# EAGLE design irTxRxComponent (EAGLE 9.5.1)
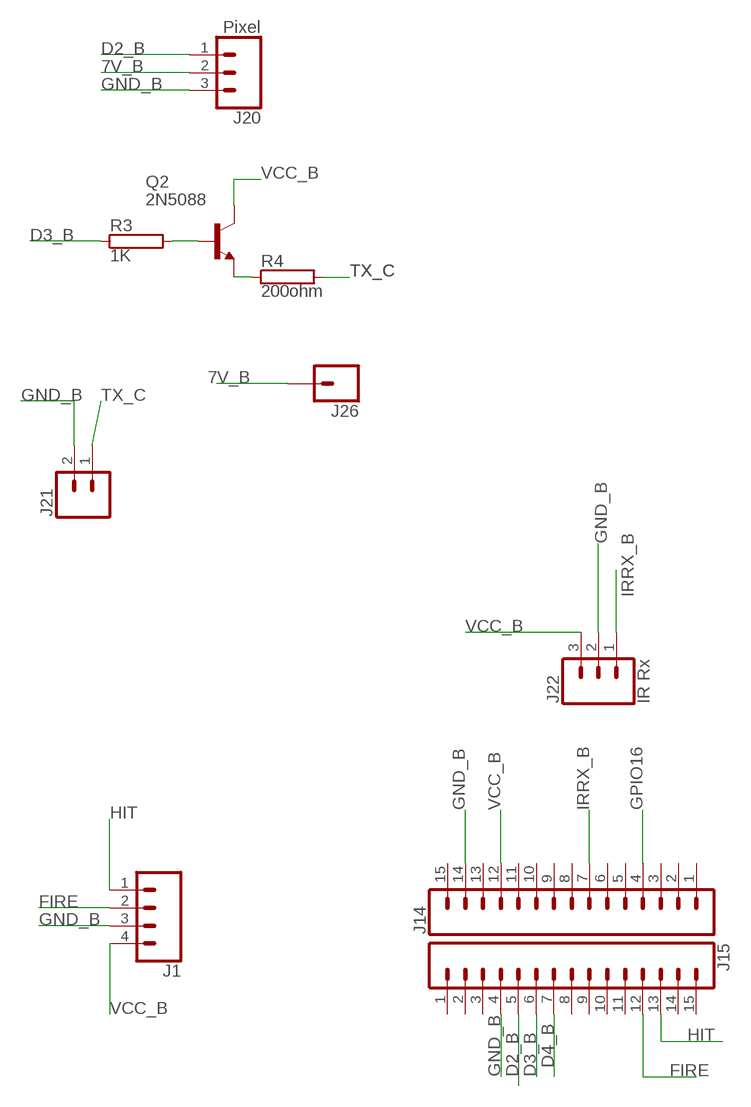
[diagram p0: schematic, sheet 1]

## Parts
J1  CONN_04  [1X04]
J14  CONN_15  [1X15]
J15  CONN_15  [1X15]
J20  Pixel  CONN_03  [1X03]
J21  CONN_02  [1X02]
J22  IR Rx  CONN_03  [1X03]
J26  CONN_01  [1X01]
Q2  2N5088  [TO92]
R3  1K  RCA0001  [CA0001]
R4  200ohm  RCA0001  [CA0001]

## Nets
7V_B: J20.2 J26.1
D2_B: J15.5 J20.1
D3_B: J15.6 R3.1
D4_B: J15.7
FIRE: J1.2 J15.12
GND_B: J1.3 J14.14 J15.4 J20.3 J21.2 J22.2
GPIO16: J14.4
HIT: J1.1 J15.13
IRRX_B: J14.7 J22.1
N$2: Q2.2(B) R3.2
N$4: Q2.3(E) R4.1
TX_C: J21.1 R4.2
VCC_B: J1.4 J14.12 J22.3 Q2.1(C)
Unconnected: J14.1 J14.2 J14.3 J14.5 J14.6 J14.8 J14.9 J14.10 J14.11 J14.13 J14.15 J15.1 J15.2 J15.3 J15.8 J15.9 J15.10 J15.11 J15.14 J15.15

## Library data of the parts
J1 = SparkFun-Connectors:CONN_04: Multi connection point. Often used as Generic Header-pin footprint for 0.1 inch spaced/style header connections On any of the 0.1 inch spaced packages, you can populate with these: Break Away Headers - Straight <https://www.sparkfun.com/products/116> (PRT-00116) Break Away Male Headers - Right Angle <https://www.sparkfun.com/products/553> (PRT-00553) Female Headers <https://www.sparkfun.com/products/115> (PRT-00115) Break Away Headers - Machine Pin <https://www.sparkfun.com/products/117> (PRT-00117) Break Away Female Headers - Swiss Machine Pin <https://www.sparkfun.com/products/743> (PRT-00743) For SCREWTERMINALS and SPRING TERMINALS visit here: Screw Terimnals on SparkFun.com <https://www.sparkfun.com/search/results?term=Screw+Terminals> (5mm/3.5mm/2.54mm spacing) This device is also useful as a general connection point to wire up your design to another part of your project. Our various solder wires solder well into these plated through hole pads. Hook-Up Wire - Assortment (Stranded, 22 AWG) <https://www.sparkfun.com/products/11375> (PRT-11375) Hook-Up Wire - Assortment (Solid Core, 22 AWG) <https://www.sparkfun.com/products/11367> (PRT-11367) View the entire wire category on our website here <https://www.sparkfun.com/categories/141> Special notes: Molex polarized connector foot print use with SKU : PRT-08231 with associated crimp pins and housings. 1MM SMD Version SKU: PRT-10208; PROD_ID: CONN-09696
J14 J15 = SparkFun-Connectors:CONN_15: Multi connection point. Often used as Generic Header-pin footprint for 0.1 inch spaced/style header connections On any of the 0.1 inch spaced packages, you can populate with these: Break Away Headers - Straight <https://www.sparkfun.com/products/116> (PRT-00116) Break Away Male Headers - Right Angle <https://www.sparkfun.com/products/553> (PRT-00553) Female Headers <https://www.sparkfun.com/products/115> (PRT-00115) Break Away Headers - Machine Pin <https://www.sparkfun.com/products/117> (PRT-00117) Break Away Female Headers - Swiss Machine Pin <https://www.sparkfun.com/products/743> (PRT-00743) For SCREWTERMINALS and SPRING TERMINALS visit here: Screw Terimnals on SparkFun.com <https://www.sparkfun.com/search/results?term=Screw+Terminals> (5mm/3.5mm/2.54mm spacing) This device is also useful as a general connection point to wire up your design to another part of your project. Our various solder wires solder well into these plated through hole pads. Hook-Up Wire - Assortment (Stranded, 22 AWG) <https://www.sparkfun.com/products/11375> (PRT-11375) Hook-Up Wire - Assortment (Solid Core, 22 AWG) <https://www.sparkfun.com/products/11367> (PRT-11367) View the entire wire category on our website here <https://www.sparkfun.com/categories/141> Special notes: Molex polarized connector foot print use with SKU : PRT-08231 with associated crimp pins and housings. 1MM SMD Version SKU: PRT-10208 NOTES ON THE VARIANTS LOCK and LOCK_LONGPADS... This footprint was designed to help hold the alignment of a through-hole component (i.e. 6-pin header) while soldering it into place. You may notice that each hole has been shifted either up or down by 0.005 of an inch from it's more standard position (which is a perfectly straight line). This slight alteration caused the pins (the squares in the middle) to touch the edges of the holes. Because they are alternating, it causes a "brace" to hold the component in place. 0.005 has proven to be the perfect amount of "off-center" position when using our standard breakaway headers. Although looks a little odd when you look at the bare footprint, once you have a header in there, the alteration is very hard to notice. Also,if you push a header all the way into place, it is covered up entirely on the bottom side.
J20 J22 = SparkFun-Connectors:CONN_03: Multi connection point. Often used as Generic Header-pin footprint for 0.1 inch spaced/style header connections On any of the 0.1 inch spaced packages, you can populate with these: Break Away Headers - Straight <https://www.sparkfun.com/products/116> (PRT-00116) Break Away Male Headers - Right Angle <https://www.sparkfun.com/products/553> (PRT-00553) Female Headers <https://www.sparkfun.com/products/115> (PRT-00115) Break Away Headers - Machine Pin <https://www.sparkfun.com/products/117> (PRT-00117) Break Away Female Headers - Swiss Machine Pin <https://www.sparkfun.com/products/743> (PRT-00743) Stackable Header - 3 Pin (Female, 0.1") <https://www.sparkfun.com/products/13875> (PRT-13875) For SCREWTERMINALS and SPRING TERMINALS visit here: Screw Terimnals on SparkFun.com <https://www.sparkfun.com/search/results?term=Screw+Terminals> (5mm/3.5mm/2.54mm spacing) This device is also useful as a general connection point to wire up your design to another part of your project. Our various solder wires solder well into these plated through hole pads. Hook-Up Wire - Assortment (Stranded, 22 AWG) <https://www.sparkfun.com/products/11375> (PRT-11375) Hook-Up Wire - Assortment (Solid Core, 22 AWG) <https://www.sparkfun.com/products/11367> (PRT-11367) View the entire wire category on our website here <https://www.sparkfun.com/categories/141> Special notes: Molex polarized connector foot print use with SKU : PRT-08232 with associated crimp pins and housings.; PROD_ID: XXX-00000; VALUE: 455-1750-1-ND
J21 = SparkFun-Connectors:CONN_02: Multi connection point. Often used as Generic Header-pin footprint for 0.1 inch spaced/style header connections On any of the 0.1 inch spaced packages, you can populate with these: Break Away Headers - Straight <https://www.sparkfun.com/products/116> (PRT-00116) Break Away Male Headers - Right Angle <https://www.sparkfun.com/products/553> (PRT-00553) Female Headers <https://www.sparkfun.com/products/115> (PRT-00115) Break Away Headers - Machine Pin <https://www.sparkfun.com/products/117> (PRT-00117) Break Away Female Headers - Swiss Machine Pin <https://www.sparkfun.com/products/743> (PRT-00743) For SCREWTERMINALS and SPRING TERMINALS visit here: Screw Terimnals on SparkFun.com <https://www.sparkfun.com/search/results?term=Screw+Terminals> (5mm/3.5mm/2.54mm spacing) This device is also useful as a general connection point to wire up your design to another part of your project. Our various solder wires solder well into these plated through hole pads. Hook-Up Wire - Assortment (Stranded, 22 AWG) <https://www.sparkfun.com/products/11375> (PRT-11375) Hook-Up Wire - Assortment (Solid Core, 22 AWG) <https://www.sparkfun.com/products/11367> (PRT-11367) View the entire wire category on our website here <https://www.sparkfun.com/categories/141> Special notes: Molex polarized connector foot print use with: PRT-08233 with associated crimp pins and housings. 2.54_SCREWTERM for use with PRT-10571. 3.5mm Screw Terminal footprints for PRT-08084 5mm Screw Terminal footprints for use with PRT-08432
J26 = SparkFun-Connectors:CONN_01: Single connection point. Often used as Generic Header-pin footprint for 0.1 inch spaced/style header connections On any of the 0.1 inch spaced packages, you can populate with these: Break Away Headers - Straight <https://www.sparkfun.com/products/116> (PRT-00116) Break Away Male Headers - Right Angle <https://www.sparkfun.com/products/553> (PRT-00553) Female Headers <https://www.sparkfun.com/products/115> (PRT-00115) Break Away Headers - Machine Pin <https://www.sparkfun.com/products/117> (PRT-00117) Break Away Female Headers - Swiss Machine Pin <https://www.sparkfun.com/products/743> (PRT-00743) This device is also useful as a general connection point to wire up your design to another part of your project. Our various solder wires solder well into these plated through hole pads. Hook-Up Wire - Assortment (Stranded, 22 AWG) <https://www.sparkfun.com/products/11375> (PRT-11375) Hook-Up Wire - Assortment (Solid Core, 22 AWG) <https://www.sparkfun.com/products/11367> (PRT-11367) View the entire wire category on our website here <https://www.sparkfun.com/categories/141> Special notes: SMTSO-256-ET is a "flush mount" nut for a 4-40 screw. We mostly use this on specialty testbeds; it is a nice way to connect hardware to your PCB at an adjustable hieght. Also note, the SNAP packages are for using a snappable style connector. We sell a baggie of snaps and they are also used on two LilyPad designs: Snap Assortment - 30 pack (male and female) <https://www.sparkfun.com/products/11347> (DEV-11347) LilyPad Arduino SimpleSnap <https://www.sparkfun.com/products/10941> (DEV-10941) LilyPad SimpleSnap Protoboard <https://www.sparkfun.com/products/10940> (DEV-10940)
Q2 = transistor-npn:2N5088: NPN Transistor
R3 R4 = resistor-power:R: Power Resitor; OC_FARNELL: unknown; OC_NEWARK: unknown

## Net classes
0 default: width 0.254 mm, clearance 0.254 mm
1 power: width 0.61 mm, drill 0.711 mm, clearance 0.33 mm
2 gnd: width 0.305 mm, drill 0.711 mm, clearance 0.254 mm
3 usbvcc: width 0.508 mm, drill 0.711 mm, clearance 0.254 mm
4 aref: width 0.406 mm

## Board
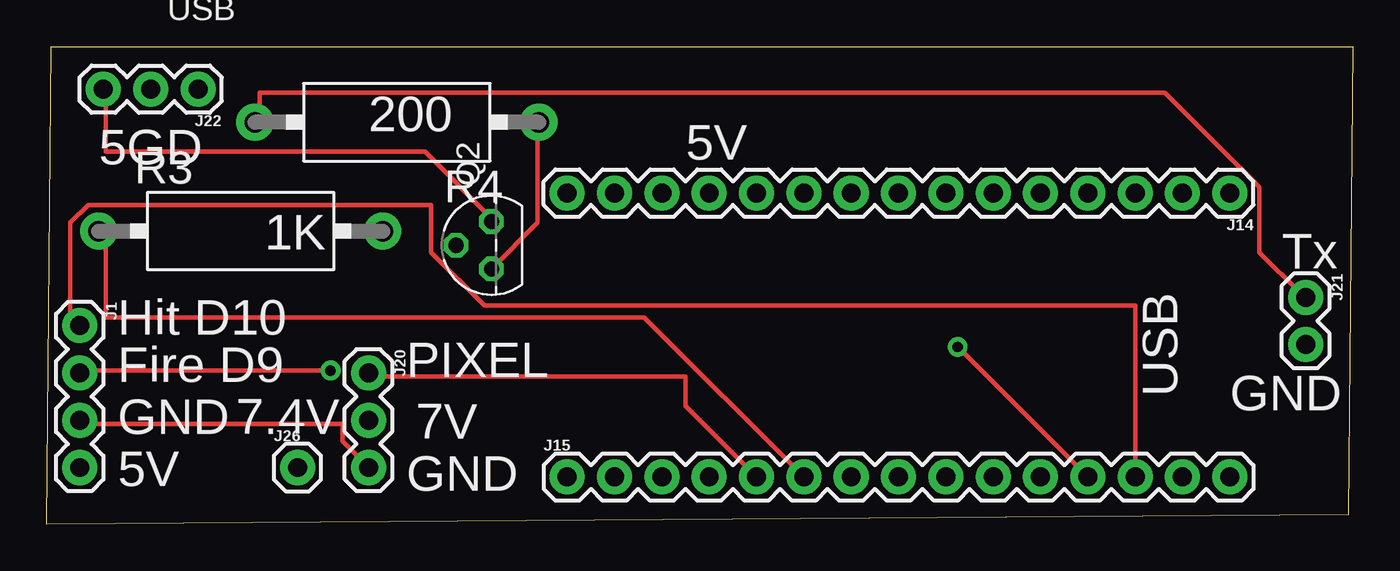
[diagram p1: board, top side]
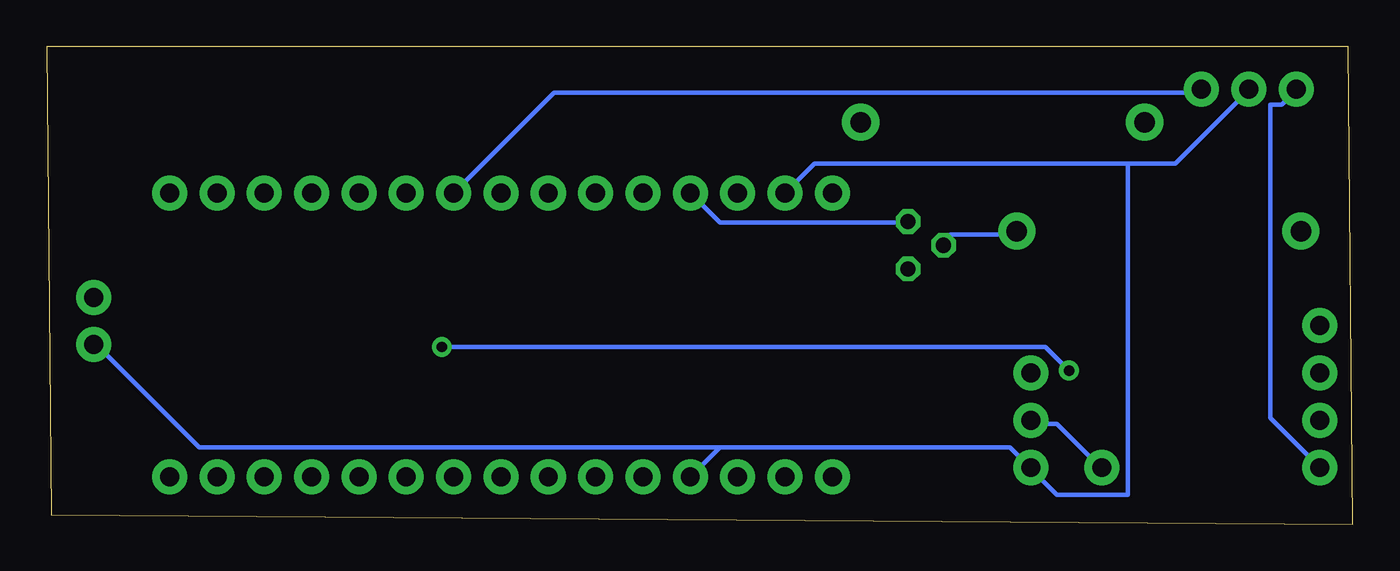
[diagram p2: board, bottom side, seen from below]

Size 70.1 x 25.65 mm. Coordinates in mm from the lower left corner, seen from the top.
Outline: 0.25,25.65 70.1,25.65 69.85,0.51 0,0 0.25,25.65
Copper layers (1*16): Top 0.035mm / dielectric 1.5mm / Bottom 0.035mm
Design rules "default": minimum track width 10mil, minimum drill 22mil, track to track 10mil, track to pad 10mil, pad to pad 10mil, via to via 16mil, smd to smd 8mil, copper to edge 30mil, drill to drill 12mil, minimum pad ring 10mil, minimum via ring 10mil, stop-mask expansion 4mil, vias tented up to drill 0mil, thermal gap 10mil
vRestrict: area 25.4,45.5 to 27.1,49.1; area 33.4,41 to 34.9,44.6; area 35.9,41 to 37.5,44.6; area 38.5,41 to 40,44.6; area 42.5,38.6 to 43.1,38.9

### Footprints (pad centres in the part's own frame; a part is rotated, then mirrored left to right if it is on the bottom)
1X04 = drill 1.016 pad 1.88: 1 0,0; 2 2.54,0; 3 5.08,0; 4 7.62,0
1X15 = drill 1.016 pad 1.88: 1 0,0; 2 2.54,0; 3 5.08,0; 4 7.62,0; 5 10.16,0; 6 12.7,0; 7 15.24,0; 8 17.78,0; 9 20.32,0; 10 22.86,0; 11 25.4,0; 12 27.94,0; 13 30.48,0; 14 33.02,0; 15 35.56,0
1X03 = drill 1.016 pad 1.88: 1 0,0; 2 2.54,0; 3 5.08,0
1X02 = drill 1.016 pad 1.88: 1 0,0; 2 2.54,0
1X01 = drill 1.016 pad 1.88: 1 0,0
TO92 = drill 0.813 octagon: 1 1.27,0; 2 0,1.905; 3 -1.27,0
CA0001 = drill 1.1 pad 2: 1 -7.62,0; 2 7.62,0

### Placement (x,y rotation side)
J1  1.78,10.67 270 top
J14  63.5,17.78 180 top
J15  27.94,2.54 0 top
J20  17.27,8.13 270 top
J21  67.56,12.19 270 top
J22  8.13,23.37 180 top
J26  13.46,3.05 0 top
Q2  23.88,14.99 90 top
R3  10.41,15.75 0 top
R4  18.8,21.59 180 top

### Tracks (layer width: path | path; a pad name or v marks a point on that pad's centre or on a via)
7V_B
  Bottom 0.254: J26.1 13.65,3.17 15.88,5.4 17.14,5.4 J20.2
D2_B
  Top 0.254: J15.5 34.29,6.35 34.29,7.94 17.46,7.94 J20.1
D3_B
  Top 0.254: J15.6 32.07,11.11 3.17,11.11 3.17,15.24 2.86,15.56 R3.1
FIRE  (via drill 0.56)
  Top 0.254: v15.24,8.26 1.91,8.26 J1.2 | J15.12 v48.9,9.53
  Bottom 0.254: v15.24,8.26 16.51,9.53 v48.9,9.53
GND_B
  Top 0.254: J20.3 15.88,4.45 15.88,5.4 1.91,5.4 J1.3
  Bottom 0.254: 12.06,19.37 28.89,19.37 J14.14 | 12.06,19.37 9.53,19.37 5.71,23.18 J22.2 | 33.97,4.13 J15.4 | 33.97,4.13 18.41,4.13 17.46,3.17 J20.3 17.14,2.86 15.88,1.59 12.06,1.59 12.06,19.37 | 33.97,4.13 61.91,4.13 67.31,9.53 J21.2
HIT
  Top 0.254: J15.13 58.42,11.75 23.5,11.75 20.64,14.61 20.64,17.14 2.22,17.14 1.27,16.19 1.27,11.11 1.59,10.79 J1.1
IRRX_B
  Bottom 0.254: J14.7 42.86,23.18 8.26,23.18 J22.1
N$2
  Bottom 0.254: Q2.2 21.91,15.24 21.59,15.56 18.1,15.56 R3.2
N$4
  Top 0.254: Q2.3 26.35,16.19 26.35,21.59 R4.1
TX_C
  Top 0.254: J21.1 67.31,12.38 65.09,14.61 65.09,18.1 60.01,23.18 11.43,23.18 11.43,21.59 R4.2
VCC_B
  Top 0.254: Q2.1 23.81,16.51 20.32,20 3.17,20 3.17,23.18 J22.3
  Bottom 0.254: J14.12 33.97,16.19 24.13,16.19 Q2.1 | J1.4 4.45,5.71 4.45,22.54 3.81,22.54 3.17,23.18 J22.3

### Text on the board
tNames: 3 2 1 0 9 8 | GND | 1 1 1 1 | AREF | PWM | PWM | PWM | USB
Reference: C8 | C2 | R11 | C4 | C5
_tsilk: 200 | 5V | 5GD | 1K | Tx | Hit D10 | Fire D9 | PIXEL | USB | GND | GND | 7.4V | 7V | 5V | GND